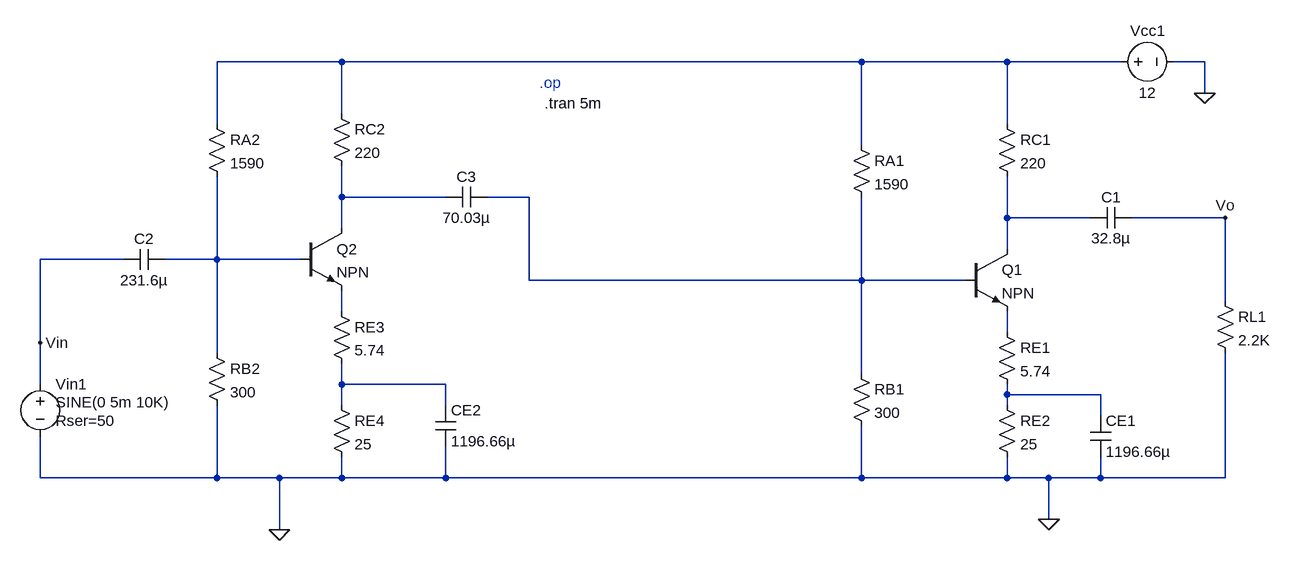
[diagram p0: schematic 2 Stage CE Amplifier.asc]
2 Stage CE Amplifier.asc, the LTspice schematic file:
Version 4.1
SHEET 1 1356 772
WIRE -80 32 -272 32
WIRE 720 32 -80 32
WIRE 944 32 720 32
WIRE 1120 32 944 32
WIRE 1248 32 1200 32
WIRE 1248 80 1248 32
WIRE -80 112 -80 32
WIRE -272 128 -272 32
WIRE 944 128 944 32
WIRE 720 160 720 32
WIRE -80 240 -80 192
WIRE 80 240 -80 240
WIRE 208 240 144 240
WIRE 944 272 944 208
WIRE 1072 272 944 272
WIRE 1280 272 1136 272
WIRE -80 288 -80 240
WIRE 944 320 944 272
WIRE -416 336 -544 336
WIRE -272 336 -272 208
WIRE -272 336 -352 336
WIRE -144 336 -272 336
WIRE 208 368 208 240
WIRE 720 368 720 240
WIRE 720 368 208 368
WIRE 880 368 720 368
WIRE 1280 400 1280 272
WIRE -80 416 -80 384
WIRE 944 448 944 416
WIRE -544 464 -544 336
WIRE -272 480 -272 336
WIRE 720 512 720 368
WIRE -544 528 -544 464
WIRE -80 528 -80 496
WIRE 80 528 -80 528
WIRE 944 544 944 528
WIRE 1088 544 944 544
WIRE -80 560 -80 528
WIRE 80 560 80 528
WIRE 944 560 944 544
WIRE 1088 576 1088 544
WIRE -544 672 -544 608
WIRE -272 672 -272 560
WIRE -272 672 -544 672
WIRE -176 672 -272 672
WIRE -80 672 -80 640
WIRE -80 672 -176 672
WIRE 80 672 80 624
WIRE 80 672 -80 672
WIRE 720 672 720 592
WIRE 720 672 80 672
WIRE 944 672 944 640
WIRE 944 672 720 672
WIRE 1008 672 944 672
WIRE 1088 672 1088 640
WIRE 1088 672 1008 672
WIRE 1280 672 1280 480
WIRE 1280 672 1088 672
WIRE 1008 736 1008 672
WIRE -176 752 -176 672
FLAG 1008 736 0
FLAG 1280 272 Vo
FLAG -176 752 0
FLAG 1248 80 0
FLAG -544 464 Vin
SYMBOL npn 880 320 R0
SYMATTR InstName Q1
SYMBOL res 928 112 R0
SYMATTR InstName RC1
SYMATTR Value 220
SYMBOL cap 1136 256 R90
WINDOW 0 0 32 VBottom 2
WINDOW 3 32 32 VTop 2
SYMATTR InstName C1
SYMATTR Value 32.8µ
SYMBOL res 1264 384 R0
SYMATTR InstName RL1
SYMATTR Value 2.2K
SYMBOL res 704 144 R0
SYMATTR InstName RA1
SYMATTR Value 1590
SYMBOL res 704 496 R0
SYMATTR InstName RB1
SYMATTR Value 300
SYMBOL voltage 1104 32 R270
WINDOW 0 32 56 VTop 2
WINDOW 3 -32 56 VBottom 2
SYMATTR InstName Vcc1
SYMATTR Value 12
SYMBOL res 928 432 R0
SYMATTR InstName RE1
SYMATTR Value 5.74
SYMBOL res 928 544 R0
SYMATTR InstName RE2
SYMATTR Value 25
SYMBOL cap 1072 576 R0
SYMATTR InstName CE1
SYMATTR Value 1196.66µ
SYMBOL npn -144 288 R0
SYMATTR InstName Q2
SYMBOL res -96 96 R0
SYMATTR InstName RC2
SYMATTR Value 220
SYMBOL res -96 400 R0
SYMATTR InstName RE3
SYMATTR Value 5.74
SYMBOL res -96 544 R0
SYMATTR InstName RE4
SYMATTR Value 25
SYMBOL cap 64 560 R0
SYMATTR InstName CE2
SYMATTR Value 1196.66µ
SYMBOL res -288 112 R0
SYMATTR InstName RA2
SYMATTR Value 1590
SYMBOL res -288 464 R0
SYMATTR InstName RB2
SYMATTR Value 300
SYMBOL cap -352 320 R90
WINDOW 0 0 32 VBottom 2
WINDOW 3 32 32 VTop 2
SYMATTR InstName C2
SYMATTR Value 231.6µ
SYMBOL voltage -544 512 R0
WINDOW 3 24 44 Left 2
WINDOW 123 24 72 Left 2
WINDOW 39 24 72 Left 2
SYMATTR Value SINE(0 5m 10K)
SYMATTR SpiceLine Rser=50
SYMATTR InstName Vin1
SYMBOL cap 80 256 R270
WINDOW 0 32 32 VTop 2
WINDOW 3 0 32 VBottom 2
SYMATTR InstName C3
SYMATTR Value 70.03µ
TEXT 224 64 Left 2 ;.op
TEXT 232 96 Left 2 !.tran 5m

The netlist it stands for:
* 2 Stage CE Amplifier.asc
Q1 N004 N003 N007 0 NPN
RC1 N001 N004 220
C1 Vo N004 32.8µ
RL1 Vo 0 2.2K
RA1 N001 N003 1590
RB1 N003 0 300
Vcc1 N001 0 12
RE1 N007 N009 5.74
RE2 N009 0 25
CE1 N009 0 1196.66µ
Q2 N002 N005 N006 0 NPN
RC2 N001 N002 220
RE3 N006 N008 5.74
RE4 N008 0 25
CE2 N008 0 1196.66µ
RA2 N001 N005 1590
RB2 N005 0 300
C2 N005 Vin 231.6µ
Vin1 Vin 0 SINE(0 5m 10K) Rser=50
C3 N002 N003 70.03µ
.model NPN NPN
.model PNP PNP
.lib standard.bjt
* .op
.tran 5m
.backanno
.end